# Altium schematic sheet Sheet1.SchDoc: ARDUINO UNO Rev3
size A3; Date: 05/07/2024; DrawnBy: Dridi Achref; DocumentNumber: 1; Revision: 1; SheetNumber: 1; SheetTotal: 1
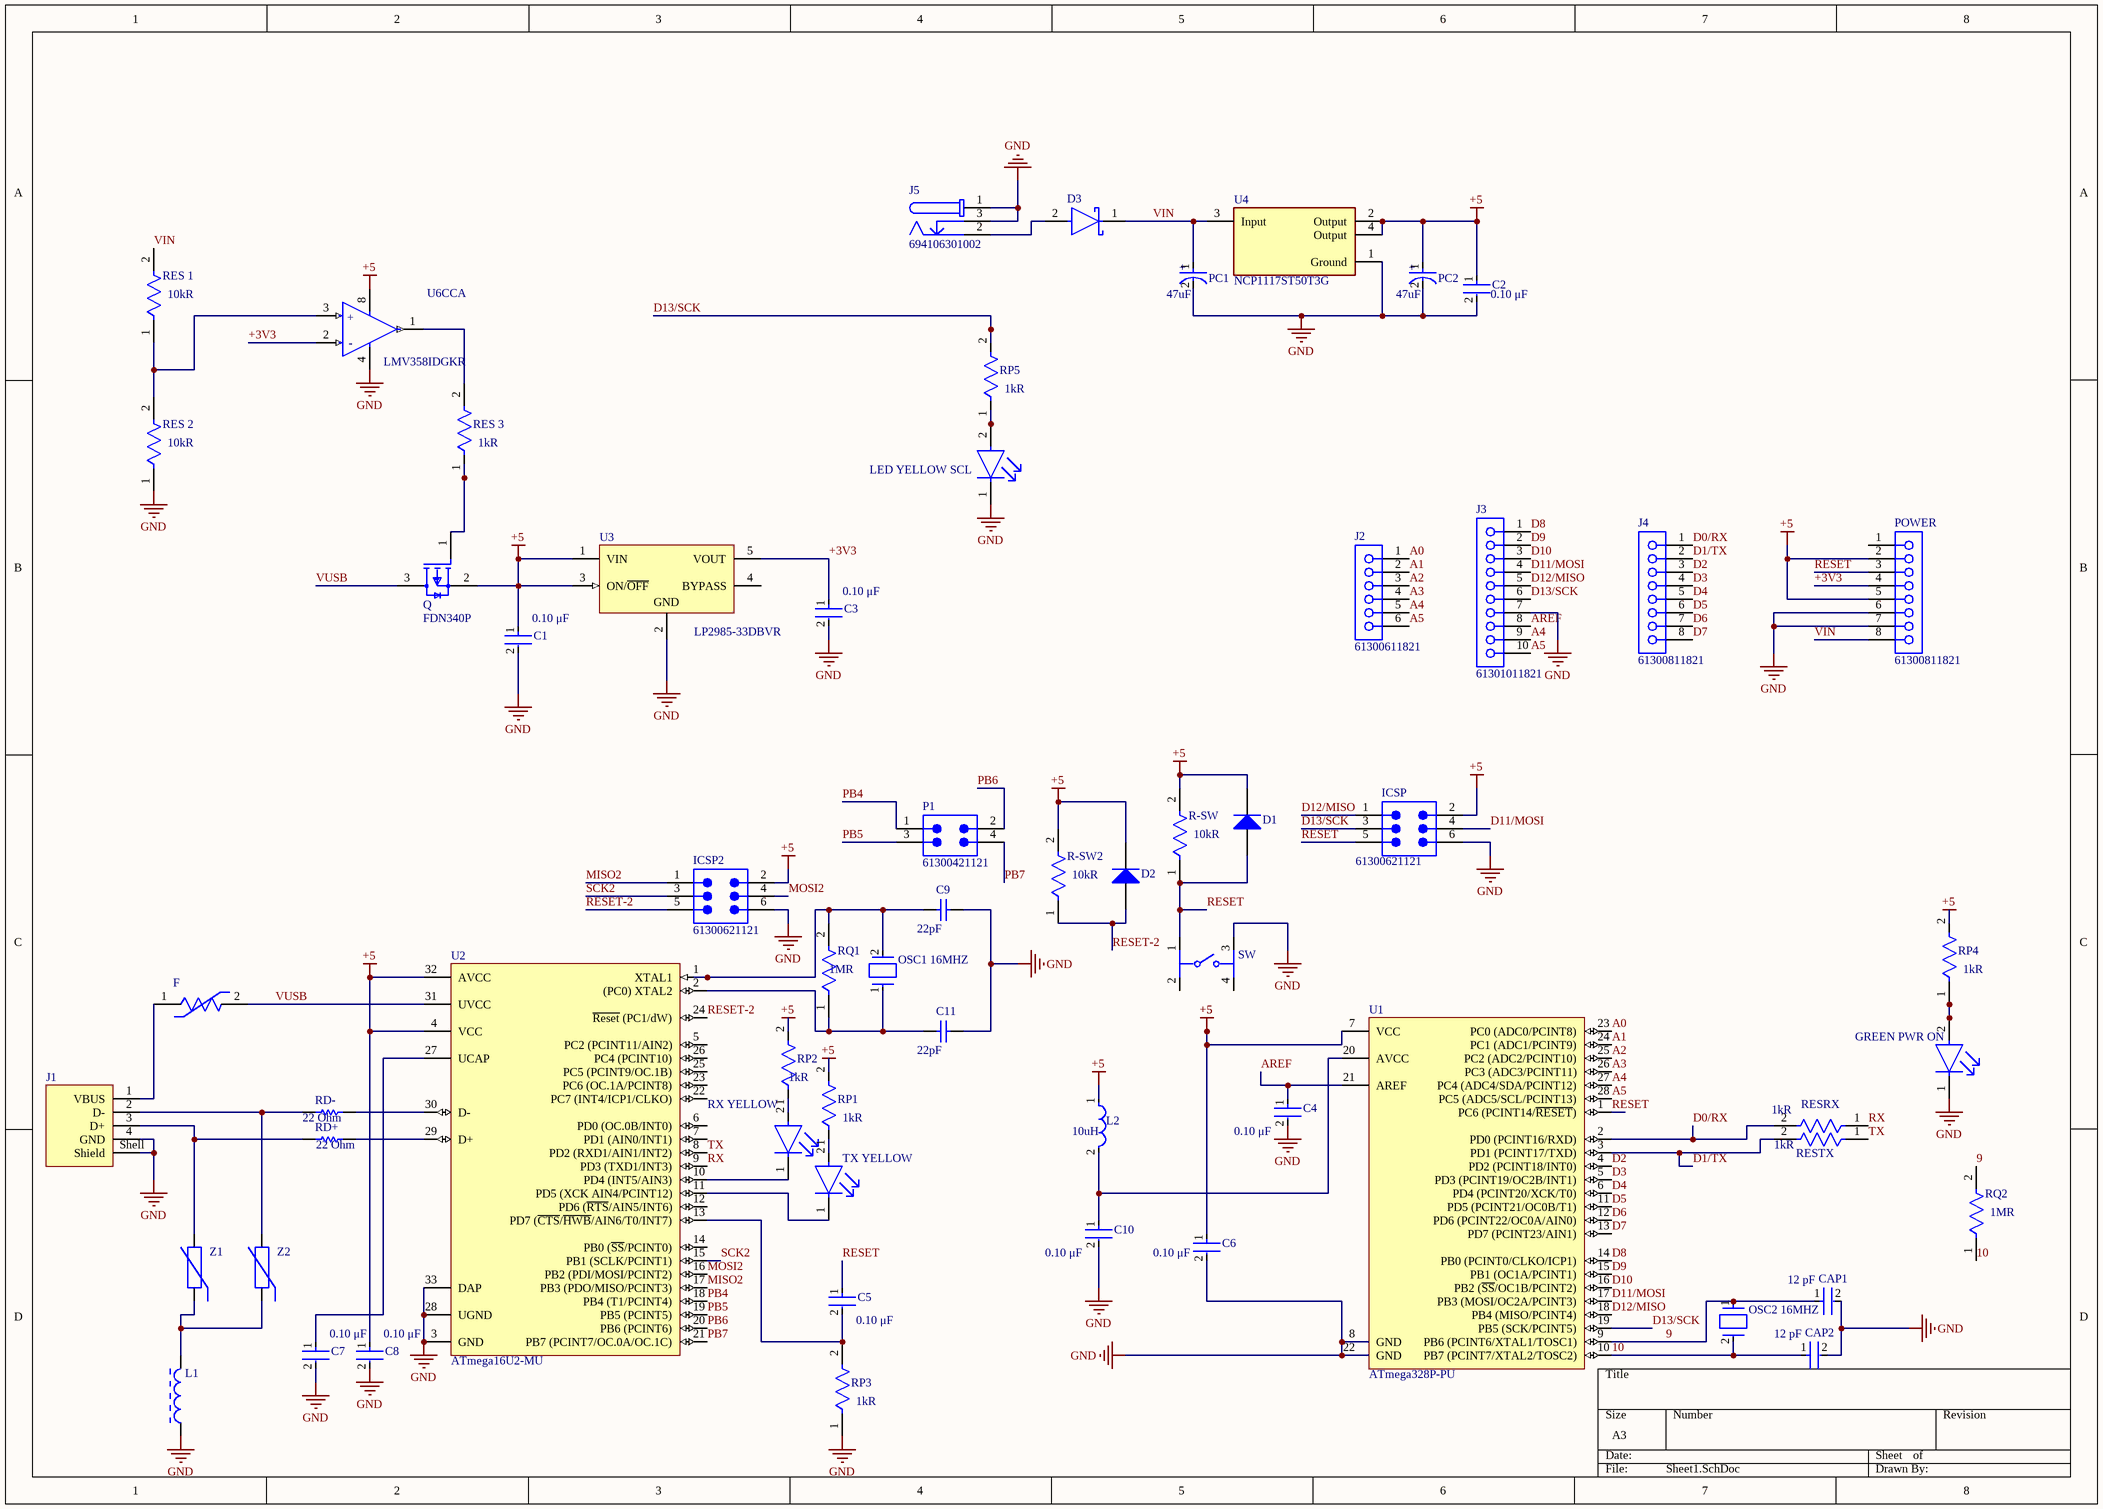
[diagram p0: Sheet1.SchDoc]

## Parts
C1  value 0.10 μF  [FP-C1206C-EB-MFG]  (hidden comment: C1206C104K2RACTU)
C2  value 0.10 μF  [FP-C1206C-EB-MFG]  (hidden comment: C1206C104K2RACTU)
C3  value 0.10 μF  [FP-C1206C-EB-MFG]  (hidden comment: C1206C104K2RACTU)
C4  value 0.10 μF  [FP-C1206C-EB-MFG]  (hidden comment: C1206C104K2RACTU)
C5  value 0.10 μF  [FP-C1206C-EB-MFG]  (hidden comment: C1206C104K2RACTU)
C6  value 0.10 μF  [FP-C1206C-EB-MFG]  (hidden comment: C1206C104K2RACTU)
C7  value 0.10 μF  [FP-C1206C-EB-MFG]  (hidden comment: C1206C104K2RACTU)
C8  value 0.10 μF  [FP-C1206C-EB-MFG]  (hidden comment: C1206C104K2RACTU)
C9  Capacitance: 22pF  [CAPC1608X90X35ML10T15]  (hidden comment: GRM1885C1H220JA01D)
C10  Capacitance: 0.10 μF  [FP-C1206C-EB-MFG]  (hidden comment: C1206C104K2RACTU)
C11  Capacitance: 22pF  [CAPC1608X90X35ML10T15]  (hidden comment: GRM1885C1H220JA01D)
CAP1  value 12 pF  [FP-C0603C-CF-MFG]  (hidden comment: C0603C120J5GACTU)
CAP2  value 12 pF  [FP-C0603C-CF-MFG]  (hidden comment: C0603C120J5GACTU)
D1  CD1206-S01575  [BOUR-CD1206-S01575-2_L]  (value not drawn)
D2  CD1206-S01575  [BOUR-CD1206-S01575-2_L]  (value not drawn)
D3  1N5819HW-7-F  [FP-SOD123-IPC_A]  (value not drawn)
F  MF-MSMF050-2  [FP-MF-MSMF050-2-MFG]  (value not drawn)
GREEN_PWR_ON  LTST-C191TBKT  [FP-LTST-C191TBKT-MFG]  (value not drawn)
ICSP  61300621121  [61300621121]
ICSP2  61300621121  [61300621121]
J1  61400416121  [61400416121]  (value not drawn)
J2  61300611821  [61300611821]
J3  61301011821  [61301011821]
J4  61300811821  [61300811821]
J5  694106301002  [694106301002]
L1  BLM21AH102SN1D  [INDC2013X105X50LL20T20]  (value not drawn)
L2  Inductance: 10uH  [FP-LB2012-1_25-0_2-IPC_C]  (hidden comment: LB2012T100KR)
LED_YELLOW_SCL  LTST-C191TBKT  [FP-LTST-C191TBKT-MFG]  (value not drawn)
OSC1_16MHZ  ABLS-16.000MHZ-K4T  [FP-ABLS-MFG]  (value not drawn)
OSC2_16MHZ  7A-16.000MAAE-T  [FP-7A-MFG]  (value not drawn)
P1  61300421121  [61300421121]
PC1  Capacitance: 47uF  [FP-FKD-MFG]  (hidden comment: EEEFK1E470P)
PC2  Capacitance: 47uF  [FP-FKD-MFG]  (hidden comment: EEEFK1E470P)
POWER  61300811821  [61300811821]
Q  FDN340P  [FP-527AG-MFG]
R-SW  Resistance: 10kR  [FP-AC0402-MFG]  (hidden comment: AC0402FR-0710KL)
R-SW2  Resistance: 10kR  [FP-AC0402-MFG]  (hidden comment: AC0402FR-0710KL)
RD+  Resistance: 22 Ohm  [RESC1005X40X25ML05T05]  (hidden comment: ERJ-2RKF22R0X)
RD-  Resistance: 22 Ohm  [RESC1005X40X25ML05T05]  (hidden comment: ERJ-2RKF22R0X)
RES_1  Resistance: 10kR  [FP-AC0402-MFG]  (hidden comment: AC0402FR-0710KL)
RES_2  Resistance: 10kR  [FP-AC0402-MFG]  (hidden comment: AC0402FR-0710KL)
RES_3  Resistance: 1kR  [FP-CRCW0603-e3-MFG]  (hidden comment: CRCW06031K00FKEA)
RESRX  Resistance: 1kR  [FP-CRCW0603-e3-MFG]  (hidden comment: CRCW06031K00FKEA)
RESTX  Resistance: 1kR  [FP-CRCW0603-e3-MFG]  (hidden comment: CRCW06031K00FKEA)
RP1  Resistance: 1kR  [FP-CRCW0603-e3-MFG]  (hidden comment: CRCW06031K00FKEA)
RP2  Resistance: 1kR  [FP-CRCW0603-e3-MFG]  (hidden comment: CRCW06031K00FKEA)
RP3  Resistance: 1kR  [FP-CRCW0603-e3-MFG]  (hidden comment: CRCW06031K00FKEA)
RP4  Resistance: 1kR  [FP-CRCW0603-e3-MFG]  (hidden comment: CRCW06031K00FKEA)
RP5  Resistance: 1kR  [FP-CRCW0603-e3-MFG]  (hidden comment: CRCW06031K00FKEA)
RQ1  Resistance: 1MR  [FP-MCR01-IPC_B]  (hidden comment: MCR01MRTF1004)
RQ2  Resistance: 1MR  [FP-MCR01-IPC_B]  (hidden comment: MCR01MRTF1004)
RX_YELLOW  LTST-C191TBKT  [FP-LTST-C191TBKT-MFG]  (value not drawn)
SW  B3FS-1000P  [FP-B3FS-1000P-MFG]  (value not drawn)
TX_YELLOW  LTST-C191TBKT  [FP-LTST-C191TBKT-MFG]  (value not drawn)
U1  ATmega328P-PU  [28P3]
U2  ATmega16U2-MU  [32PG_N]
U3  LP2985-33DBVR  [DBV0005A_M]
U4  NCP1117ST50T3G  [FP-318H-MFG]
U6CC  LMV358IDGKR  [FP-DGK0008A-IPC_B]  (part A of 2)
Z1  CG0603MLC-05E  [BOUR-CG0603-2_V]  (value not drawn)
Z2  CG0603MLC-05E  [BOUR-CG0603-2_V]  (value not drawn)

## Nets
+5: C1.1 C2.1 C6.1 C8.1 D1.2(K) D2.2(K) ICSP.2 ICSP2.2 L2.1 PC2.1(C) POWER.2 POWER.5 Q.2(S) R-SW.2 R-SW2.2 RP1.2 RP2.2 RP4.2 U1.7(VCC) U2.4(VCC) U2.32(AVCC) U3.1(VIN) U3.3(ON/~{OFF}) U4.2(Output) U4.4(Output) U6CC.8(VCC+)
GND: C1.2 C2.2 C3.2 C4.2 C6.2 C7.2 C8.2 C9.2 C10.2 C11.2 CAP1.2 CAP2.2 GREEN_PWR_ON.1(C) ICSP.6 ICSP2.6 J1.4(GND) J1.Shell(Shield) J3.7 J5.1 J5.3 L1.1 LED_YELLOW_SCL.1(C) PC1.2(A) PC2.2(A) POWER.6 POWER.7 RES_2.1 RP3.1 SW.3 U1.8(GND) U1.22(GND) U2.3(GND) U2.28(UGND) U2.33(DAP) U3.2(GND) U4.1(Ground) U6CC.4(GND)
9: CAP1.1 OSC2_16MHZ.1 RQ2.2 U1.9(PB6_(PCINT6/XTAL1/TOSC1))
10: CAP2.1 OSC2_16MHZ.2 RQ2.1 U1.10(PB7_(PCINT7/XTAL2/TOSC2))
+3V3: C3.1 POWER.4 U3.5(VOUT) U6CC.2(1IN-)
A0: J2.1 U1.23(PC0_(ADC0/PCINT8))
A1: J2.2 U1.24(PC1_(ADC1/PCINT9))
A2: J2.3 U1.25(PC2_(ADC2/PCINT10))
A3: J2.4 U1.26(PC3_(ADC3/PCINT11))
A4: J2.5 J3.9 U1.27(PC4_(ADC4/SDA/PCINT12))
A5: J2.6 J3.10 U1.28(PC5_(ADC5/SCL/PCINT13))
AREF: C4.1 J3.8 U1.21(AREF)
D0/RX: J4.1 RESRX.2 U1.2(PD0_(PCINT16/RXD))
D1/TX: J4.2 RESTX.2 U1.3(PD1_(PCINT17/TXD))
D2: J4.3 U1.4(PD2_(PCINT18/INT0))
D3: J4.4 U1.5(PD3_(PCINT19/OC2B/INT1))
D4: J4.5 U1.6(PD4_(PCINT20/XCK/T0))
D5: J4.6 U1.11(PD5_(PCINT21/OC0B/T1))
D6: J4.7 U1.12(PD6_(PCINT22/OC0A/AIN0))
D7: J4.8 U1.13(PD7_(PCINT23/AIN1))
D8: J3.1 U1.14(PB0_(PCINT0/CLKO/ICP1))
D9: J3.2 U1.15(PB1_(OC1A/PCINT1))
D10: J3.3 U1.16(PB2_(~{SS}/OC1B/PCINT2))
D11/MOSI: ICSP.4 J3.4 U1.17(PB3_(MOSI/OC2A/PCINT3))
D12/MISO: ICSP.1 J3.5 U1.18(PB4_(MISO/PCINT4))
D13/SCK: ICSP.3 J3.6 RP5.2 U1.19(PB5_(SCK/PCINT5))
MISO2: ICSP2.1 U2.17(PB3_(PDO/MISO/PCINT3))
MOSI2: ICSP2.4 U2.16(PB2_(PDI/MOSI/PCINT2))
PB4: P1.1 U2.18(PB4_(T1/PCINT4))
PB5: P1.3 U2.19(PB5_(PCINT5))
PB6: P1.2 U2.20(PB6_(PCINT6))
PB7: P1.4 U2.21(PB7_(PCINT7/OC.0A/OC.1C))
RESET: C5.1 D1.1(A) ICSP.5 POWER.3 R-SW.1 SW.1 U1.1(PC6_(PCINT14/~{RESET}))
RESET-2: D2.1(A) ICSP2.5 R-SW2.1 U2.24(~{Reset}_(PC1/dW))
RX: RESRX.1 U2.9(PD3_(TXD1/INT3))
SCK2: ICSP2.3 U2.15(PB1_(SCLK/PCINT1))
TX: RESTX.1 U2.8(PD2_(RXD1/AIN1/INT2))
VIN: D3.1(C) PC1.1(C) POWER.8 RES_1.2 U4.3(Input)
VUSB: F.2 Q.3(D) U2.31(UVCC)
NetC5_2: C5.2 RP3.2 U2.13(PD7_(~{CTS}/~{HWB}/AIN6/T0/INT7))
NetC7_1: C7.1 U2.27(UCAP)
NetC9_1: C9.1 OSC1_16MHZ.2 RQ1.2 U2.1(XTAL1)
NetC10_1: C10.1 L2.2 U1.20(AVCC)
NetC11_1: C11.1 OSC1_16MHZ.1 RQ1.1 U2.2((PC0)_XTAL2)
NetD3_2: D3.2(A) J5.2
NetF_1: F.1 J1.1(VBUS)
NetGREEN_PWR_ON_2: GREEN_PWR_ON.2(A) RP4.1
NetJ1_2: J1.2(D-) RD-.1 Z2.2
NetJ1_3: J1.3(D+) RD+.1 Z1.2
NetL1_2: L1.2 Z1.1 Z2.1
NetLED_YELLOW_SCL_2: LED_YELLOW_SCL.2(A) RP5.1
NetQ_1: Q.1(G) RES_3.1
NetRD+_2: RD+.2 U2.29(D+)
NetRD-_2: RD-.2 U2.30(D-)
NetRES_1_1: RES_1.1 RES_2.2 U6CC.3(1IN+)
NetRES_3_2: RES_3.2 U6CC.1(1OUT)
NetRP1_1: RP1.1 TX_YELLOW.2(A)
NetRP2_1: RP2.1 RX_YELLOW.2(A)
NetRX_YELLOW_1: RX_YELLOW.1(C) U2.10(PD4_(INT5/AIN3))
NetTX_YELLOW_1: TX_YELLOW.1(C) U2.11(PD5_(XCK_AIN4/PCINT12))

Not connected (* = marked no-connect by the designer): POWER 1; SW 2 4; U2 5(PC2_(PCINT11/AIN2)) 6(PD0_(OC.0B/INT0)) 7(PD1_(AIN0/INT1)) 12(PD6_(~{RTS}/AIN5/INT6)) 14(PB0_(~{SS}/PCINT0)) 22(PC7_(INT4/ICP1/CLKO)) 23(PC6_(OC.1A/PCINT8)) 25(PC5_(PCINT9/OC.1B)) 26(PC4_(PCINT10)); U3 4(BYPASS)

## Notes on the sheet
- (in symbol CMP-2100-03651-2, part A) +; -
- (in symbol CMP-05427-000093-1) +

## Library data of the parts
C1-C8 = CMP-1037-04222-2: CAP CER 0.1UF 200V 10% X7R 1206; Manufacturer: KEMET; Automotive Grade: Grade 0; Tolerance: 0.1; Material: Ceramic; Temperature Coefficient: 15%; Automotive: Yes; Temperature Characteristic: X7R; Digikey Description: CAP CER 0.1UF 200V 10% X7R 1206; ComponentLink2URL: https://content.kemet.com/datasheets/KEM_C1007_X8R_ULTRA_150C_SMD.pdf; Voltage Rating: 200 V; Manufacturer Part Number: C1206C104K2RACTU; Temperature Range High: +150°C; Device Class L1: Passive Components; Octopart: https://octopart.com/c1206c104k2ractu-kemet-9138344; Temperature: -55°C to +150°C; Height: 0.88mm; Device Class L3: Ceramic Capacitors; Lead Free: Yes; Package: C1206C-EB; Category: Cap; Temperature Range Low: -55°C; Mouser Description: Multilayer Ceramic Capacitors MLCC - SMD/SMT 200volts 0.1uF X7R 10%; Ipc Land Pattern Name: CAPC320160X78; Capacitance: 0.10 μF; RoHS: TRUE; ComponentLink2Description: Datasheet; Device Class L2: Capacitors
C9 C11 = CMP-2000-04945-1: Chip Capacitor, 22 pF, +/- 5%, 50 V, -55 to 125 degC, 0603 (1608 Metric), RoHS, Tape and Reel; Manufacturer: Murata; Rated Voltage: 50V; Dielectric: C0G; Manufacturer URL: http://www.murata.com/; Datasheet Version: Jul-06; Package Reference: 603; Tolerance (%): ±5%; Case Size/Dimension: 0603; Package Description: 2-Pin Surface Mount Device, Body 1.6 x 0.8 mm; Datasheet URL: https://datasheet.ciiva.com/11786/0900766b807a1cab-11786398.pdf
C10 = CMP-1037-04222-2: CAP CER 0.1UF 200V 10% X7R 1206; Manufacturer: KEMET; Automotive Grade: Grade 0; Tolerance: 0.1; Value: 0.10 μF; Material: Ceramic; Temperature Coefficient: 15%; Automotive: Yes; Temperature Characteristic: X7R; Digikey Description: CAP CER 0.1UF 200V 10% X7R 1206; ComponentLink2URL: https://content.kemet.com/datasheets/KEM_C1007_X8R_ULTRA_150C_SMD.pdf; Voltage Rating: 200 V; Manufacturer Part Number: C1206C104K2RACTU; Temperature Range High: +150°C; Device Class L1: Passive Components; Octopart: https://octopart.com/c1206c104k2ractu-kemet-9138344; Temperature: -55°C to +150°C; Height: 0.88mm; Device Class L3: Ceramic Capacitors; Lead Free: Yes; Package: C1206C-EB; Category: Cap; Temperature Range Low: -55°C; Mouser Description: Multilayer Ceramic Capacitors MLCC - SMD/SMT 200volts 0.1uF X7R 10%; Ipc Land Pattern Name: CAPC320160X78; RoHS: TRUE; ComponentLink2Description: Datasheet; Device Class L2: Capacitors
CAP1 CAP2 = CMP-2006-03703-3: Ceramic Capacitor 12Pf 50V, C0G, 5%, 0603, Full Reel; Manufacturer: KEMET; Automotive Grade: Grade 1; Temperature Coefficient: 30ppm/°C; Tolerance: 0.05; Temperature Range High: +125°C; Temperature Characteristic: C0G; Temperature Range Low: -55°C; Voltage Rating: 50 V; Mouser Description: Ceramic Capacitor 12Pf 50V, C0G, 5%, 0603, Full Reel; Package: C0603C-CF; Temperature: -55°C to +125°C; Device Class L3: Ceramic Capacitors; Material: Ceramic; Lead Free: Yes; ComponentLink2URL: https://api.kemet.com/component-edge/download/datasheet/C0603C100J5GACAUTO.pdf; Category: Cap; Capacitance: 12 pF; ComponentLink2Description: Datasheet; Device Class L1: Passive Components; Height: 0.87mm; Device Class L2: Capacitors; Digikey Description: Ceramic Capacitor 12Pf 50V, C0G, 5%, 0603, Full Reel; RoHS: TRUE; Manufacturer Part Number: C0603C120J5GACTU; Octopart: https://octopart.com/c0603c120j5gactu-kemet-108780; Automotive: Yes
D1 D2 = CMP-0583-00001-2: 75 V Small Signal Switching Diode, 150 mA, 2.5 uA, 1026 Molded Package, RoHS, Tape and Reel; Manufacturer: Bourns; Reverse Voltage: 75 V; Average Forward Current: 150 mA; Reverse Current (Max.): 2.5 uA; Capacitance Between Terminals (Max.): 3 pF; Reverse Recovery Time (Max.): 4 nS; Forward Voltage (Max.): 1.00 V; Packing: Tape and Reel; Mounting Technology: Surface Mount; DatasheetVersion: Rev. 06/11; ComponentLink2URL: http://www.bourns.com/data/global/pdfs/CD1206_S01575.pdf; PackageReference: CD1206-S01575-2; RoHS: TRUE; ComponentLink1URL: http://www.bourns.com/; ComponentLink1Description: Manufacturer URL; ComponentLink3Description: Package Specification; ComponentLink3URL: http://www.bourns.com/data/global/pdfs/CD1206_S01575.pdf; ComponentLink2Description: Datasheet; PackageDescription: 2-Pin SMD, Body 3.2 x 1.5 mm; PartNumber: CD1206-S01575
D3 = CMP-0303-00003-3: DIODE SCHOTTKY 40V 1A SOD123; Forward Voltage: 450mV; Capacitance: 110pF; Max Forward Surge Current (Ifsm): 25A; Peak Reverse Current: 50uA; Polarity: Standard; Element Configuration: Single; Max Power Dissipation: 450mW; Min Operating Temperature: -65°C; Package Quantity: 3000; Contact Plating: Tin; Weight: 0.000353oz; Max Repetitive Reverse Voltage (Vrrm): 40V; Max Reverse Voltage (DC): 40V; Height: 1.25mm; Average Rectified Current: 1A; Width: 1.7mm; Case/Package: SOD-123-2; Lead Free: Lead Free; Max Operating Temperature: 125°C; Current Rating: 1A; Termination: SMD/SMT; Forward Current: 1A; Radiation Hardening: No; Number of Pins: 2; Length: 2.85mm; Voltage Rating (DC): 40V; REACH SVHC: No SVHC; Peak Non-Repetitive Surge Current: 25A; Packaging: Tape and Reel; Output Current: 1A
F = CMP-2100-03653-2: PTC RESET FUSE 15V 500MA 1812; Manufacturer: Bourns; Value: 0.15-1Ω; Trip Current: 1A; Automotive Grade: Grade 3; Trip Time: 0.15s; Current Rating: 100A; Hold Current: 0.5A; Height: 0.85mm; Package: 1812; Voltage Rating: 15V; Temperature Range High: +85°C; Device Class L2: PTC Resettable Fuses; Lead Free: Yes; ComponentLink2URL: http://www.bourns.com/docs/Product-Datasheets/mfmsmf.pdf; Ambient Temperature Range High: +85°C; Mouser Description: PTC Resettable Fuse 0.5A(hold) 1A(trip) 15V 100A 0.8W 0.15s 0.15Ohm SMD Solder Pad 1812 T/R; Digikey Description: PTC RESET FUSE 15V 500MA 1812; Manufacturer Part Number: MF-MSMF050-2; Resistance: 0.15-1Ω; Category: Fuse; ComponentLink2Description: Datasheet; Automotive: Yes; Temperature Range Low: -40°C; RoHS: TRUE; Device Class L1: Circuit Protection; Temperature: -40°C to +85°C; Octopart: https://octopart.com/mf-msmf050-2-bourns-28047; Ambient Temperature Range Low: -40°C; Device Class L3: unset
GREEN_PWR_ON LED_YELLOW_SCL RX_YELLOW TX_YELLOW = CMP-22017-000008-1: LED BLUE CLEAR CHIP SMD; Lens Color: Colorless; Dominant Wavelength: 475nm; Forward Current: 20mA; Wavelength: 468nm; Viewing Angle: 130°; Power Dissipation: 76mW; Luminous Intensity: 180mcd; Reverse Voltage: 5V; Number of Elements: 1; Lens Style: Diffused; Forward Voltage: 3.8V; Max Power Dissipation: 75mW; Case Code (Metric): 1608; Packaging: Tape and Reel; Case/Package: 0603; Depth: 1.6mm; Mount: Surface Mount; Lead Free: Lead Free; Min Operating Temperature: -20°C; Lens Transparency: Clear; Illumination Color: Blue; Height: 0.55mm; Test Current: 20mA; Case Code (Imperial): 0603; Max Operating Temperature: 80°C; Number of Pins: 2; Length: 0.8mm; Radiation Hardening: No; Package Quantity: 1; Number of LEDs: 1; Width: 0.8mm; Color: Blue
ICSP ICSP2 = CMP-1502-01072-3: NexarPartId: 32855529; Row Spacing: 2.54mm; Current Rating: 3A; Voltage Rating: 250V; Contact Resistance: 20mΩ; Connector Type: Male Pin; Number of Positions: 6; Gender: Male; Termination: Solder; Orientation: Vertical; Max Operating Temperature: 105°C; Contact Plating: Gold; Height: 8.89mm; Contact Mating Length: 5.9944mm; Mount: Through Hole; Min Operating Temperature: -40°C; Lead Pitch: 2.54mm; Number of Pins: 6; Operating Supply Voltage: 250V; Color: Black; Pitch: 2.54mm; Packaging: Bulk; Contact Material: Copper; REACH SVHC: Unknown; RoHS: Compliant; Number of Rows: 2; Number of Contacts: 6
J1 = CMP-1502-03243-3: NexarPartId: 21041529; Operating Supply Voltage: 30V; Gender: Receptacle; Number of Contacts: 4; Current Rating: 1.5A; Connector Type: USB; Contact Resistance: 20mΩ; Insulation Resistance: 1GΩ; USB Standard: USB 2.0; Number of Ports: 1; REACH SVHC: Unknown; Termination: Solder; Color: White; Contact Plating: Gold; Flammability Rating: UL94 V-0; Voltage Rating: 30V; Insulation Material: PBT; Number of Positions: 4; Number of Pins: 4; Max Operating Temperature: 105°C; Min Operating Temperature: -40°C; Width: 16.2mm; RoHS: Compliant; Contact Material: Gold; Orientation: Horizontal; Height: 11.25mm; Mount: Horizontal, PCB, Through Hole; Length: 14.7mm; Voltage Rating (DC): 30V
J2 = CMP-1502-01322-3: NexarPartId: 21642411; Current Rating: 3A; Operating Supply Voltage: 250V; Contact Resistance: 20mΩ; Gender: Female; Number of Pins: 6; Orientation: Vertical; Lead Pitch: 2.54mm; RoHS: Compliant
J3 = CMP-1502-01332-3: NexarPartId: 18818160; Connector Type: Header, Socket; Number of Contacts: 10; Voltage Rating: 250V; Contact Resistance: 20mΩ; Insulation Resistance: 1GΩ; Current Rating: 3A; Insulation: Insulated; Pitch: 2.54mm; Gender: Female; Termination: Through Hole; Min Operating Temperature: -40°C; Lead Free: Lead Free; Length: 25.9mm; Number of Rows: 1; Width: 25.9mm; REACH SVHC: Unknown; Housing Material: PBT; Number of Pins: 10; Orientation: Vertical; Mount: Through Hole; RoHS: Compliant; Height: 8.5mm; Operating Supply Voltage: 250V; Flammability Rating: UL94 V-0; Contact Gender: Female; Color: Black; Contact Plating: Gold; Contact Material: Copper; Lead Pitch: 2.54mm; Number of Positions: 10; Max Operating Temperature: 125°C
J4 POWER = CMP-1502-01327-3: NexarPartId: 61924723; Current Rating: 3A; Gender: Female; Contact Resistance: 20mΩ; Operating Supply Voltage: 250V; Lead Pitch: 2.54mm; RoHS: Non-Compliant; Orientation: Vertical; Number of Pins: 8
J5 = CMP-1502-00188-2: NexarPartId: 52676100; Voltage Rating (DC): 20V; Gender: Male; Voltage Rating: 24V; Connector Type: Power; Insulation Resistance: 100MΩ; Current Rating: 5A; Shielding: Unshielded; Number of Contacts: 3; Color: Black; Housing Material: Polyamide; Contact Gender: Female; REACH SVHC: Unknown; Termination: Through Hole; Height: 11mm; RoHS: Compliant; Mount: Through Hole; Flammability Rating: UL94 V-0; Packaging: Bulk; Min Operating Temperature: -40°C; Contact Plating: Tin; Max Operating Temperature: 85°C; Operating Supply Voltage: 24V; Contact Material: Gold, Tin
L1 = CMP-2000-05954-1: Chip Bead, 1000 Ohm, +/- 25%, 200 mA, -55 to 85 degC, 2-Pin SMD, RoHS, Tape and Reel; Manufacturer: Murata; Brand: MurataElectronics; Test Frequency: 100MHz; Maximum DC Resistance: 450mOhms; Case Length: 2mm; Maximum DC Current: 200mA; Case Height: 0.85mm; Case Width: 1.25mm; Impedance: 1kOhms; Datasheet URL: http://datasheet.octopart.com/BLM21AH102SN1D-Murata-datasheet-629859.pdf; Datasheet Version: 11/2017; Dimensions: 1.25mmWx2mmLx0.85mmH; Manufacturer URL: http://www.murata.com/; Packaging: Reel; Product: FerriteChipBeads; Product Category: EMIFilterBeads,Chips&Arrays; Operating Temperature Range: -55Cto+125C; Package / Case: 0805(2012metric); Series: BLM21A; Mounting Technology: SurfaceMount; Termination Style: SMD/SMT; Tolerance: 25%; RoHS: Details; Package Reference: 0805; Factory Pack Quantity: 4000; Package Description: 2-Pin Surface Mount Device, Body 2 x1.25 mm
L2 = CMP-14484-001064-1: SMD Inductors 10uH ±10% 0.12A 0.65Ω 0805; Current Rating: 120mA; Self Resonant Frequency: 32MHz; DC Resistance (DCR): 500mR; Core Material: Ferrite; Test Frequency: 2.52MHz; Shielding: Unshielded; Number of Pins: 2; Halogen Free: Halogen Free; Packaging: Tape and Reel; Radiation Hardening: No; Depth: 1.45mm; Package Quantity: 3000; RoHS Compliant: Yes; Max DC Current: 120mA; Lead Free: Lead Free; Length: 0.079inch; Case Code (Metric): 2012; Min Operating Temperature: -40°C; Mount: Surface Mount; Width: 1.25mm; DC Current: 120mA; Resistor Type: Wirewound; Termination: SMD/SMT; Case Code (Imperial): 0805; Case/Package: 0805; Tolerance: 10%; Height - Seated (Max): 0.057inch; Series: LB; Height: 1.25mm; Inductance Tolerance: 10%; Military Standard: Not; Max Operating Temperature: 105°C
OSC1_16MHZ = CMP-27762-000003-1: CRYSTAL 16.0000MHZ 18PF SMD; Manufacturer: Abracon; Frequency: 16MHz; Stability: 50ppm; Tolerance: 30ppm; Standoff Height: 0mm; Esr: 40Ω; ComponentLink2URL: https://abracon.com/Resonators/abls.pdf; Temperature Range High: +125°C; Package: ABLS; Device Class L3: Crystals; Temperature: -40°C to +125°C; Load Capacitance: 18pF; Device Class L2: Crystals / Oscillators; Mouser Description: Crystal 16MHz ±30ppm (Tol) ±50ppm (Stability) 18pF FUND 40Ohm 2-Pin HC-49/US SMD T/R; Category: Crys; ComponentLink2Description: Datasheet; Manufacturer Part Number: ABLS-16.000MHZ-K4T; Series: ABLS; Automotive: No; Octopart: https://octopart.com/abls-16.000mhz-k4t-abracon-18618626; RoHS: TRUE; Digikey Description: CRYSTAL 16.0000MHZ 18PF SMD; Temperature Range Low: -40°C; Lead Free: Yes; Height: 4.3mm; Device Class L1: Passive Components
OSC2_16MHZ = CMP-18717-000387-1: Quartz Crystal 16MHz, 30ppm, 12pF, 50Ω; ESR (Equivalent Series Resistance): 50R; Length: 0.197inch; Max Operating Temperature: 85°C; Frequency Stability: 30ppm; Number of Pins: 2; Series: 7A; Load Capacitance: 12pF; Frequency Tolerance: 30ppm; Width: 3.2mm; Mount: Surface Mount; Case/Package: SMD/SMT; Package Quantity: 1000; Height: 0.053inch; Lead Free: Contains Lead; Tolerance: 30ppm; Min Operating Temperature: -40°C; Termination: SMD/SMT; Packaging: Tape and Reel; Frequency: 16MHz
P1 = CMP-1502-01066-4: NexarPartId: 32855524; Number of Positions: 4; Operating Supply Voltage: 250V; Pitch: 2.54mm; Connector Type: Male Pin; Current Rating: 3A; Contact Resistance: 20mΩ; Gender: Male; Number of Pins: 4; Max Operating Temperature: 105°C; Number of Contacts: 4; Contact Mating Length: 5.9944mm; Min Operating Temperature: -40°C; Orientation: Vertical; Height: 8.89mm; Mount: Through Hole; Lead Pitch: 2.54mm; Contact Material: Copper; Color: Black; Voltage Rating: 250V; RoHS: Compliant; Termination: Solder; Row Spacing: 2.54mm; Contact Plating: Gold; Number of Rows: 2; Lead Free: Lead Free; REACH SVHC: Unknown; Packaging: Bulk
PC1 PC2 = CMP-05427-000093-1: CAP ALUM 47UF 20% 25V SMD; Polarity: Polar; Leakage Current: 3uA; Ripple Current: 240mA; Impedance: 360mR; Dielectric Material: Aluminium; Life (Hours): 2000Hour; Radiation Hardening: No; Termination: SMD/SMT; Height - Seated (Max): 0.24inch; Diameter: 6.3mm; RoHS Compliant: Yes; Voltage Rating: 25V; Ripple Current (AC): 240mA; Tolerance: 20%; Max Operating Temperature: 105°C; Min Operating Temperature: -55°C; Number of Pins: 2; Voltage: 25V; Height: 5.8mm; Series: FK; Width: 7.8mm; REACH SVHC: No SVHC; Construction: Cylindrical; Mount: Surface Mount; Contact Plating: Tin; Length: 5.8mm; Package Quantity: 1000; ESR (Equivalent Series Resistance): 360mR; Lead Free: Lead Free; Voltage Rating (DC): 25V; Packaging: Tape and Reel; Case/Package: Radial
Q = CMP-2100-03638-2: MOSFET P-CH 20V 2A SSOT3; Fall Time: 11ns; Rise Time: 9ns; Voltage Rating (DC): -20V; Power Dissipation: 500mW; Nominal Vgs: -800mV; Current Rating: -2A; Gate to Source Voltage (Vgs): 8V; Rds On Max: 70mR; Turn-Off Delay Time: 27ns; Element Configuration: Single; Number of Elements: 1; Input Capacitance: 779pF; Drain to Source Resistance: 60mR; Turn-On Delay Time: 10ns; Package Quantity: 1; Mount: Surface Mount; Case/Package: SOT-23; Min Operating Temperature: -55°C; REACH SVHC: No SVHC; Weight: 0.03g; Packaging: Tape and Reel; Threshold Voltage: -800mV; Max Operating Temperature: 150°C; Dual Supply Voltage: -20V; Termination: SMD/SMT; Drain to Source Voltage (Vdss): 20V; Height: 0.94mm; Length: 2.92mm; Contact Plating: Tin; Width: 3.05mm; Drain to Source Breakdown Voltage: -20V; Max Power Dissipation: 500mW; Continuous Drain Current (ID): 2A; Number of Pins: 3; Lead Free: Lead Free; Radiation Hardening: No; On-State Resistance: 70MR
R-SW R-SW2 RES_1 RES_2 = CMP-2002-01790-3: RES 10kΩ ±1% 0.063W 0402; Power Rating: 62.5mW; Voltage Rating: 50V; Temperature Coefficient: 100ppm/°C; Max Power Dissipation: 63mW; Tolerance: 1%; Military Standard: Not; Construction: Rectangular; Termination: SMD/SMT; Max Operating Temperature: 155°C; Min Operating Temperature: -55°C; Height: 0.015inch; Lead Free: Lead Free; Width: 0.02inch; Case/Package: 0402; Resistor Type: Thick Film; Series: AC; Features: Moisture Resistant; RoHS Compliant: Yes; Number of Terminations: 2; Case Code (Metric): 1005; Length: 0.039inch; Depth: 0.5mm; Size Code: 0402; Packaging: Tape and Reel; Case Code (Imperial): 0402
RD+ RD- = CMP-2002-01135-4: Chip Resistor, 22 Ohm, +/- 1%, 0.1 W, -55 to 155 degC, 0402 (1005 Metric), RoHS, Tape and Reel; Case\/Package: 0402; Power Rating: 100 mW; Voltage Rating: 50 V; ComponentLink2Description: Datasheet; PartNumber: ERJ-2RKF22R0X; Packaging: Tape and Reel; Weight: 2.8E-05oz; Pins: 2; Case Code (Imperial): 0402; Width: 0.5 mm; ComponentLink2URL: http://industrial.panasonic.com/cdbs/www-data/pdf/RDA0000/AOA0000C86.pdf; Height: 0.35 mm; PackageReference: 0402; REACH SVHC: Yes; Min Operating Temperature: -55 degC; Length: 1 mm; DatasheetVersion: 04/2015; RoHSCompliant: true; Package Quantity: 10000; Case Code (Metric): 1005; PackageDescription: 2-Pin Surface Mount Device, Body 1 x 0.5 mm; ComponentLink1URL: http://www.panasonic.com/; Mount: Surface Mount; Mounting Technology: Surface Mount; Tolerance: 1%; Max Operating Temperature: 155 degC; ComponentLink1Description: Manufacturer URL
RES_3 RESRX RESTX RP1-RP5 = CMP-1666-00003-5: RES Thick Film, 1kΩ, 1%, 0.1W, 100ppm/°C, 0603; Max Power Dissipation: 100mW; Voltage Rating: 75V; Max Operating Temperature: 155°C; Number of Pins: 2; Case Code (Imperial): 0603; Width: 0.033inch; Power Rating: 100mW; Number of Terminations: 2; Package Quantity: 10; Weight: 7.1E-05oz; Tolerance: 1%; Temperature Coefficient: 100ppm/°C; Military Standard: Not; Mount: Surface Mount; Voltage Rating (DC): 75V; Depth: 0.85mm; Composition: Thick Film; Radiation Hardening: No; Termination: SMD/SMT; Length: 1.55mm; Case Code (Metric): 1608; Contact Plating: Tin; Min Operating Temperature: -55°C; Packaging: Tape and Reel; Height: 0.45mm; Lead Free: Lead Free; Case/Package: 0603; Features: Automotive AEC-Q200
RQ1 RQ2 = CMP-08839-019445-1: Thick Film Chip Resistor, 0402, 1MΩ, 1%, 100ppm/°C, 0.063W, 50V; Max Power Dissipation: 63mW; Lead Free: Lead Free; Case Code (Imperial): 0402; Max Operating Temperature: 155°C; Package Quantity: 1; Length: 0.039inch; Temperature Coefficient: 100ppm/°C; Case Code (Metric): 1005; Tolerance: 1%; Case/Package: 0402; RoHS Compliant: Yes; Number of Terminations: 2; Resistor Type: Thick Film; Height: 0.016inch; Packaging: Tape and Reel; Min Operating Temperature: -55°C; Voltage Rating (DC): 50V; Width: 0.02inch; Series: MCR
SW = CMP-08834-000003-2: SWITCH TACTILE SPST-NO 0.05A 24V; Switch Function: Off-Mom; Max Current Rating: 50mA; Throw Configuration: SPST; Switch Travel: 0.25mm; Number of Poles: 1; Actuator Length: 0.5mm; Ratings: IP00; Mechanical Life: 1000000Cycles; Illumination Type: Non-Illuminated; Actuator Color: Black; Operating Force: 0.98N; Contact Resistance: 100mR; Actuator Type: Standard; Material: Plastic; Min Operating Temperature: -25°C; Length: 6.3mm; Contact Plating: Silver; Series: B3FS; Max Operating Temperature: 70°C; Contact Material: Silver; Current Rating: 50mA; Depth: 8mm; Mount: Surface Mount; Package Quantity: 1; Max Voltage Rating (DC): 24V; Case/Package: SMD/SMT; Packaging: Tape and Reel; Orientation: Straight; Weight: 0.2g; Electrical Life: 1000000Cycles; Contact Current Rating: 50mA; Lead Free: Lead Free; Termination: Gull Wing; Voltage Rating (DC): 24V
U1 = CMP-0095-00013-2: 8-bit AVR Microcontroller, 32KB Flash, 1KB EEPROM, 2KB SRAM, 28-pin PDIP, Industrial Grade (-40°C to 85°C); RevisionNote: DatasheetVersion updated. URLs added.; PackageVersion: revB, Sep-2001; PackageDescription: 28-lead (0.300"/7.62mm Wide) Plastic Dual Inline Package (PDIP); DatasheetVersion: revD, May-2011; ComponentLink1Description: Manufacturer URL; ComponentLink1URL: http://www.atmel.com/; PackageReference: 28P3; ComponentLink2Description: ATmega48A/48PA/88A/88PA/168A/168PA/328/328P Datasheet; ComponentLink3URL: http://www.atmel.com/dyn/resources/prod_documents/8271S.pdf; ComponentLink2URL: http://www.atmel.com/dyn/resources/prod_documents/8271.pdf; ComponentLink3Description: ATmega48A/48PA/88A/88PA/168A/168PA/328/328P Summary
U2 = CMP-0095-00115-3: 8-bit AVR Microcontroller, 2.7-5.5V, 16KB Flash, 512 Bytes EEPROM, 512 Bytes SRAM, 32-pin VQFN, Industrial Grade (-40°C to 85°C); ComponentLink1Description: Manufacturer URL; RevisionNote: Schematic symbol corrected; ComponentLink3URL: http://www.atmel.com/dyn/resources/prod_documents/7799S.pdf; ComponentLink2URL: http://www.atmel.com/dyn/resources/prod_documents/doc7799.pdf; PackageReference: 32PG; DatasheetVersion: revD, Nov-2010; PartNumber: ATmega16U2-MU; PackageVersion: revA, Oct-2008; Code_JEDEC: MO-220WHHD-2; PackageDescription: 32-Pin Quad Flat No-Lead (QFN) Sawn,  5 x 5 x 1.0 mm Body, Pitch 0.50 mm, 3.60mm Exposed Pad; ComponentLink2Description: ATmega8U2/16U2/32U2 Datasheet; ComponentLink1URL: http://www.atmel.com/; ComponentLink3Description: ATmega8U2/16U2/32U2 Summary
U3 = CMP-0758-00080-2: Single Output Low Noise LDO, 150 mA, Fixed 3.3 V Output, 1.5% Tolerance, 2.2 to 16 V Input, Low IQ, 5-Pin SOT-23 (DBV), -40 to 125 degC, Green (RoHS & no Sb/Br), Tape and Reel; Manufacturer: Texas Instruments; Vdo (Typ) (mV): 280; Accuracy (%): 1.5; Output Options: Fixed Output; Fixed Output Options (V): 3.3; Iout (Max) (A): 0.15; Iq (Typ) (mA): 0.85; ComponentLink3Description: Package Specification; Packing: Tape and Reel; ComponentLink3URL: http://www.ti.com/litv/pdf/mpds018j; Vin (V): 2.2 to 16; Mounting Technology: Surface Mount; ComponentLink1URL: http://www.ti.com/; PartNumber: LP2985-33DBVR; PackageReference: DBV0005A; ComponentLink2URL: http://www.ti.com/lit/ds/symlink/lp2985-50.pdf; RoHS: TRUE; ComponentLink2Description: Datasheet; PackageVersion: 4073253-4/L; Operating Temperature Range (degC): -40 to 125; DatasheetVersion: SLVS522N; ComponentLink1Description: Manufacturer URL; PackageDescription: 5-Pin Plastic Small Outline, Body 2.9 x 1.6 mm, Pitch 0.95 mm
U4 = CMP-0592-00001-4: IC REG LINEAR 5V 1A SOT223; Output Voltage Accuracy: 1%; Number of Outputs: 1; Dropout Voltage: 1.2V; Polarity: Positive; Power Rating: 781mW; Input Bias Current: 6mA; Quiescent Current: 10mA; Output Type: Fixed; Max Input Voltage: 20V; Min Input Voltage: 3.5V; Max Operating Temperature: 125°C; Number of Pins: 4; Case/Package: SOT-223; Min Operating Temperature: 0°C; Accuracy: 1%; Contact Plating: Tin; Min Current Limit: 1A; Output Current: 1A; Max Output Current: 1A; Length: 6.7mm; Packaging: Tape and Reel; Package Quantity: 1; Height: 1.69mm; REACH SVHC: No SVHC; Width: 3.7mm; Halogen Free: Halogen Free; RoHS Compliant: Yes; Nominal Output Voltage: 5V; Lead Free: Lead Free; Radiation Hardening: No; Tolerance: 1%; Number of Regulators: 1; Output Voltage: 5V
U6CC = CMP-2100-03651-2: IC OPAMP GP 2 CIRCUIT 8VSSOP; Operating Supply Current: 210uA; Number of Channels: 2; Common Mode Rejection Ratio: 50dB; Input Offset Voltage (Vos): 7mV; Slew Rate: 1V/µs; Output Current: 160mA; Nominal Supply Current: 440uA; Voltage Gain: 100dB; Input Bias Current: 250nA; Gain Bandwidth Product: 1MHz; Min Supply Voltage: 2.7V; Max Supply Voltage: 5.5V; Mount: Surface Mount; Packaging: Tape and Reel; Length: 3mm; Package Quantity: 1; Min Operating Temperature: -40°C; Width: 3mm; Height: 0.97mm; Max Operating Temperature: 125°C; REACH SVHC: No SVHC; Radiation Hardening: No; Power Supply Rejection Ratio (PSRR): 50dB; Lead Free: Lead Free; Case/Package: MSOP; Contact Plating: Gold; Number of Circuits: 2; Unity Gain Bandwidth Product: 1MHz; Number of Pins: 8; Bandwidth: 1MHz; Output Current per Channel: 160mA; Number of Amplifiers: 2; Number of Elements: 2
Z1 Z2 = CMP-0584-00001-2: ESD Protector, 5 V Supply, -40 to 85 degC, 1.6 x 0.8 x 0.55 mm SMD, RoHS, Tape and Reel; Manufacturer: Bourns; VC: 20 V; VT: 150 V; RT: 1 ns; VDC: 5 V; CO: 0.5 pF; PartNumber: CG0603MLC-05E; ComponentLink1Description: Manufacturer URL; ComponentLink1URL: http://www.bourns.com/; Packing: Tape and Reel; Mounting Technology: Surface Mount; ComponentLink2Description: Datasheet; RoHS: TRUE; Operating Temperature: -40 to 85 degC; DatasheetVersion: Rev. S; PackageDescription: 2-Pin SMD, Body 1.6 x 0.8 mm, Pitch 1.52 mm; PackageReference: CG0603-2; ComponentLink2URL: http://www.bourns.com/data/global/pdfs/MLC.pdf